# Altium schematic sheet Communicate.SchDoc
size A4; PageSetup: Record=PageOptions|CenterHorizontal=True|CenterVertical=True|PrintScale=0.97|XCorrection=1.00|YCorrection=1.00|PrintKind=0|BorderSize=5000000|LeftOffset=0|BottomOffset=0|Orientation=2|PaperLength=1000|PaperWidth=1000|Scale=100|PaperSource=7|PrintQuality=-4|MediaType=1|DitherType=10|PaperKind=A4|PrintScaleMode=1
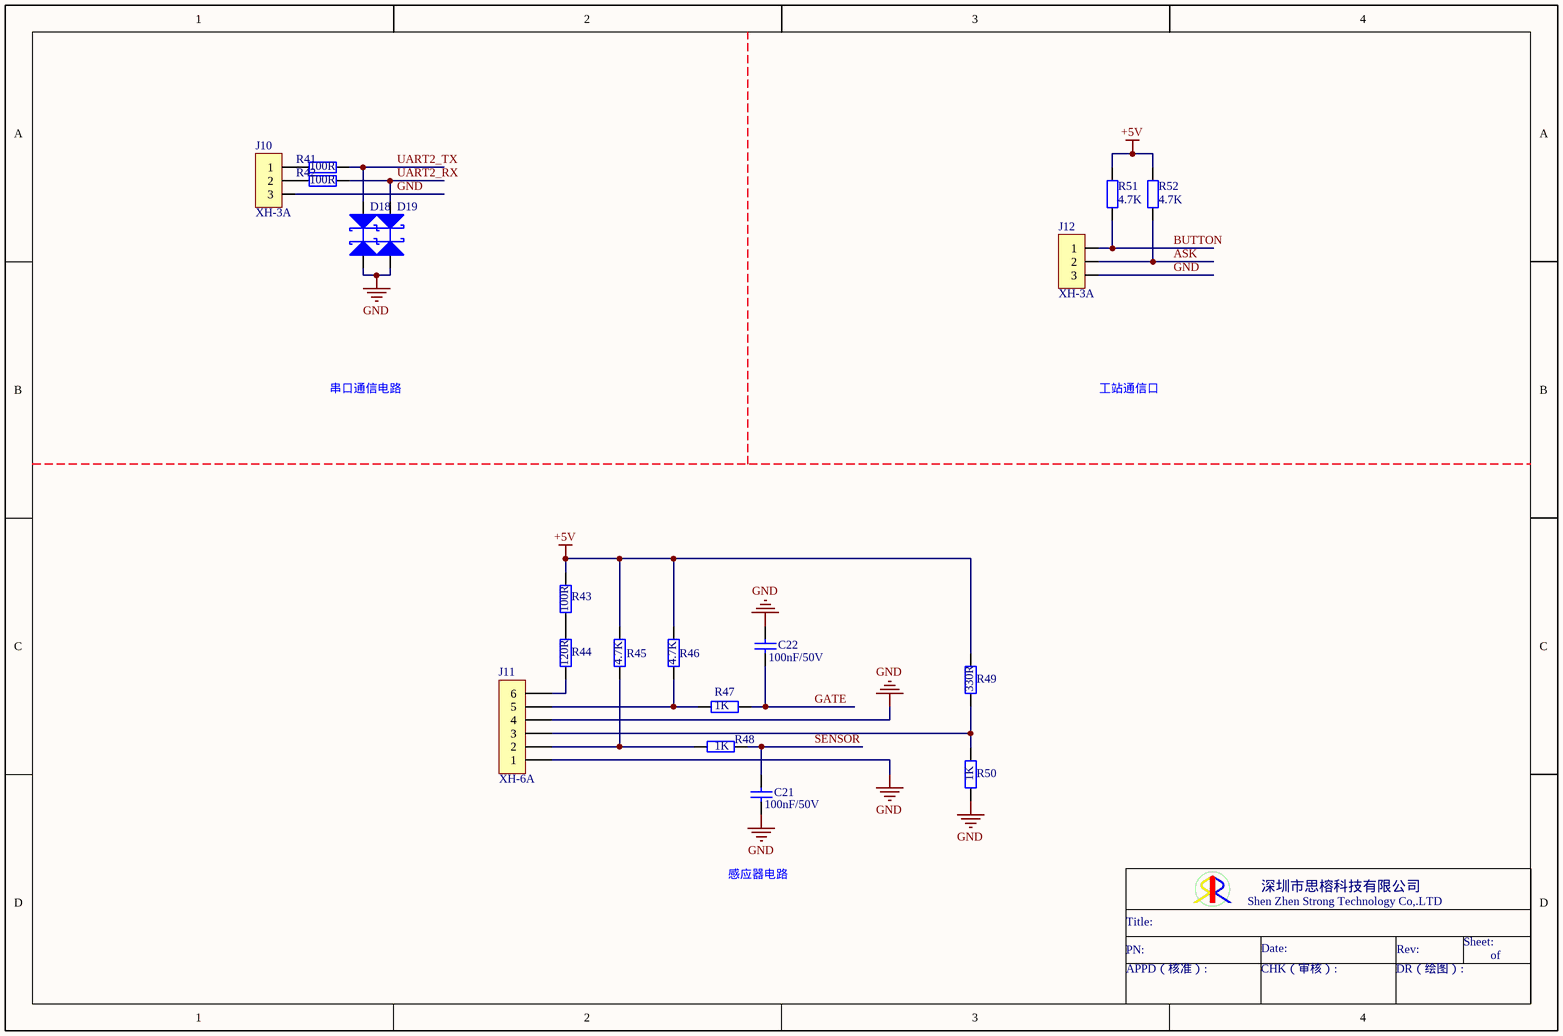
[diagram p0: Communicate.SchDoc]

## Parts
C21  100nF/50V  [0603C]
C22  100nF/50V  [0603C]
D18  ESD5B5.0ST1G  [SOD-523]  (value not drawn)
D19  ESD5B5.0ST1G  [SOD-523]  (value not drawn)
J10  XH-3A  [CN3-2.54]
J11  XH-6A  [CN6-2.54]
J12  XH-3A  [CN3-2.54]
R41  100R  [0603R]
R42  100R  [0603R]
R43  100R  [0603R]
R44  120R  [0603R]
R45  4.7K  [0603R]
R46  4.7K  [0603R]
R47  1K  [0603R]
R48  1K  [0603R]
R49  330R  [0603R]
R50  1K  [0603R]
R51  4.7K  [0603R]
R52  4.7K  [0603R]

## Nets
+5V: R43.2 R45.2 R46.2 R49.2 R51.2 R52.2
GND: C21.1 C22.1 D18.1 D19.1 J10.3 J11.1 J11.4 J12.3 R50.1
ASK: J12.2 R52.1
BUTTON: J12.1 R51.1
GATE: C22.2 R47.2
SENSOR: C21.2 R48.2
UART2_RX: D19.2 R42.2
UART2_TX: D18.2 R41.2
NetJ10_1: J10.1 R41.1
NetJ10_2: J10.2 R42.1
NetJ11_2: J11.2 R45.1 R48.1
NetJ11_3: J11.3 R49.1 R50.2
NetJ11_5: J11.5 R46.1 R47.1
NetJ11_6: J11.6 R44.1
NetR43_1: R43.1 R44.2

## Notes on the sheet
- 串口通信电路
- 工站通信口
- 感应器电路
- Shen Zhen Strong Technology Co,.LTD
- 深圳市思榕科技有限公司
- Title:
- PN:
- APPD（核准）:
- Date:
- CHK（审核）:
- DR（绘图）:
- Rev:
- Sheet:
- of

## Library data of the parts
C21 C22 = C100nF/50V-0603: 瓷片电容,100nF,5%,X7R,50V,0603; 料号: 10201-10032-00; 品名: 瓷片电容
D18 D19 = ESD5B5.0ST1G: TVS管,5V,SOD-523; 料号: 10405-00037-00; 品名: TVS管
J10 J12 = CONN-XH-3A: CONN,XH-3A,3PIN,2.54mm插座; 料号: 10701-00004-00; 品名: 线对板连接器
J11 = CONN-XH-6A: CONN,XH-6A,6PIN,2.54mm插座; 料号: 10701-00013-00; 品名: 线对板连接器
R41-R43 = R100R-0603: 金属膜电阻,100R,1%,1/10W,0603; 料号: 10101-10002-00; 品名: 金属膜电阻
R44 = R120R: 金属膜电阻,120R,5W,5%; 料号: 10107-12000-00; 品名: 金属膜电阻
R45 R46 R51 R52 = R4.7K-0603: 金属膜电阻,4.7K,1%,1/10W,0603; 料号: 10101-47012-00; 品名: 金属膜电阻
R47 R48 R50 = R1K-0603: 金属膜电阻,1K,1%,1/10W,0603; 料号: 10101-10012-00; 品名: 金属膜电阻
R49 = R330R-0603: 金属膜电阻,330R,1%,1/10W,0603; 料号: 10101-33002-00; 品名: 金属膜电阻